# Altium schematic sheet rs485.SchDoc
size A4
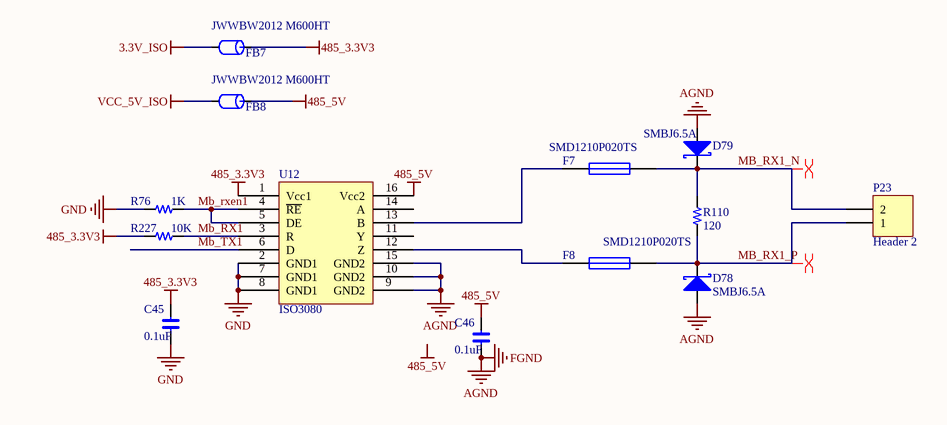
[diagram p0: rs485.SchDoc]

## Parts
C45  0.1uF  [0603C]
C46  0.1uF  [0603C]
D78  SMBJ6.5A  [SMB]
D79  SMBJ6.5A  [SMB]
F7  SMD1210P020TS  [1206R]
F8  SMD1210P020TS  [1206R]
FB7  JWWBW2012 M600HT  [0805CZ]
FB8  JWWBW2012 M600HT  [0805CZ]
P23  Header 2  [2X2.54MMZ]
R76  1K  [0603R]
R110  120  [0603R]
R227  10K  [0603R]
U12  ISO3080  [SO-16]

## Nets
3.3V_ISO: FB7.2
485_3.3V3: C45.2 FB7.1 R227.2 U12.1(Vcc1)
485_5V: C46.2 FB8.1 U12.16(Vcc2)
AGND: C46.1 D78.1(A) D79.1(A) U12.9(GND2) U12.10(GND2) U12.15(GND2)  [also labelled FGND]
GND: C45.1 R76.2 U12.2(GND1) U12.7(GND1) U12.8(GND1)
VCC_5V_ISO: FB8.2
Mb_RX1: R227.1 U12.3(R)
MB_RX1_N: D79.2(K) F7.2 P23.2 R110.1
MB_RX1_P: D78.2(K) F8.2 P23.1 R110.2
Mb_rxen1: R76.1 U12.4(~{RE}) U12.5(DE)
Mb_TX1: U12.6(D)
NetF7_1: F7.1 U12.13(B)
NetF8_1: F8.1 U12.12(Z)

Not connected (* = marked no-connect by the designer): U12 11(Y) 14(A)

## Layout directives
differential pair: MB_RX1_N, MB_RX1_P

## Notes on the sheet
- Labels drawn without touching a wire or pin: 485_5V

## Library data of the parts
C45 C46 = C
D78 D79 = DIODE S: Schottky Diode
F7 F8 = Fuse 1: Fuse; Published: 8-Jun-2000; LatestRevisionDate: 17-Jul-2002; LatestRevisionNote: Re-released for DXP Platform.; PackageReference: PIN-W2/E2.8; Publisher: Altium Limited
FB7 FB8 = FB: Part Field 1: 磁珠/0603/1K ohm/100MHz; FB: BLM18BD102SN1(muRata); Text Field1: FB
P23 = Header 2: Header, 2-Pin; LatestRevisionDate: 17-Jul-2002; LatestRevisionNote: Re-released for DXP Platform.; Publisher: Altium Limited
R76 R110 R227 = R